# Altium schematic sheet Deneigus_Servo.SchDoc
size Tabloid; Sheet_Name: Alimentation Servo-moteur; Size: 11x17
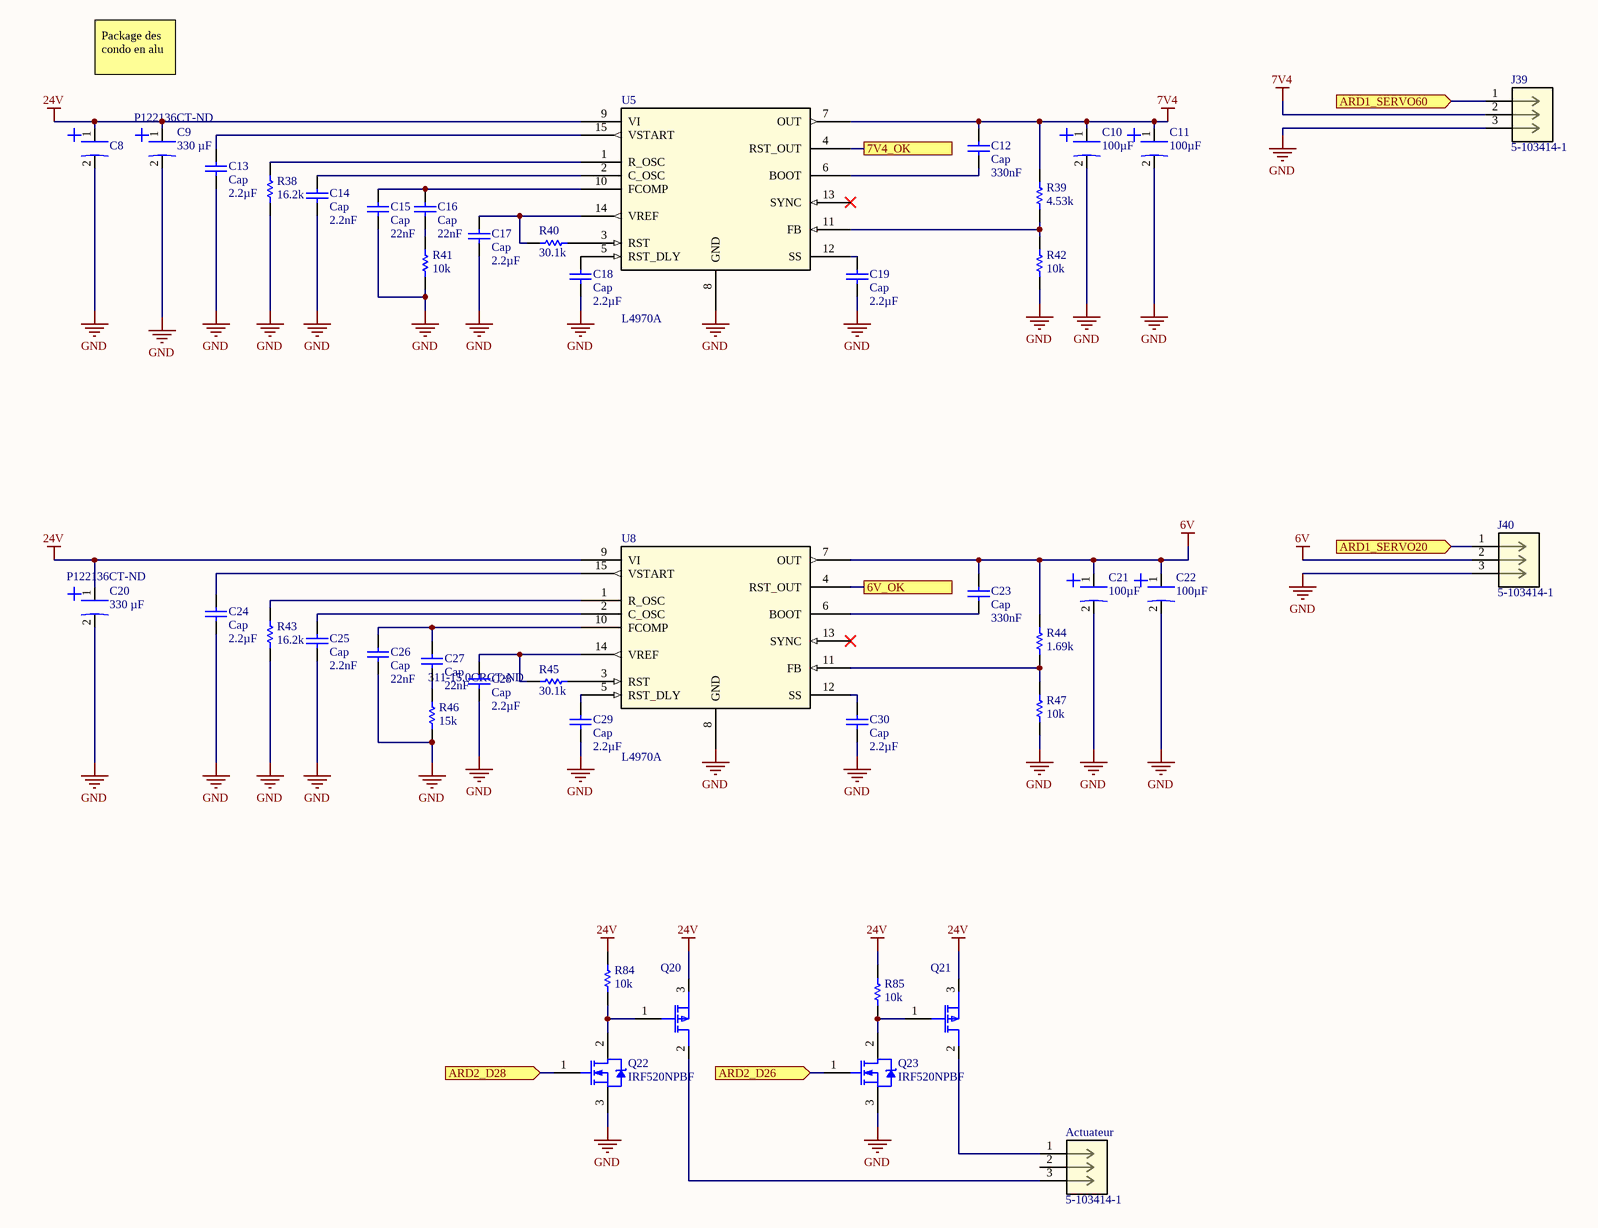
[diagram p0: Deneigus_Servo.SchDoc]

## Parts
Actuateur  5-103414-1  [CONN_5-103414-1_TYCO]
C8  CAP ALUM 3300UF 20% 50V SNAP  [3300 uF 50V Cap]  (value not drawn)
C9  value 330 µF  Supplier Part Number 1: P122136CT-ND  [330uF (10.3x10.3mm)]  (hidden comment: CAP ALUM POLY 47UF 20% 16V SMD)
C10  value 100µF  [47uF]  (hidden comment: CAP ALUM POLY 47UF 20% 16V SMD)
C11  value 100µF  [47uF]  (hidden comment: CAP ALUM POLY 47UF 20% 16V SMD)
C12  Cap  value 330nF  [CAP_0805]
C13  Cap  value 2.2µF  [CAP_0805]
C14  Cap  value 2.2nF  [CAP_0805]
C15  Cap  value 22nF  [RAD-0.3]
C16  Cap  value 22nF  [RAD-0.3]
C17  Cap  value 2.2µF  [CAP_0805]
C18  Cap  value 2.2µF  [CAP_0805]
C19  Cap  value 2.2µF  [CAP_0805]
C20  value 330 µF  Supplier Part Number 1: P122136CT-ND  [330uF (10.3x10.3mm)]  (hidden comment: CAP ALUM POLY 47UF 20% 16V SMD)
C21  value 100µF  [47uF]  (hidden comment: CAP ALUM POLY 47UF 20% 16V SMD)
C22  value 100µF  [47uF]  (hidden comment: CAP ALUM POLY 47UF 20% 16V SMD)
C23  Cap  value 330nF  [CAP_0805]
C24  Cap  value 2.2µF  [CAP_0805]
C25  Cap  value 2.2nF  [CAP_0805]
C26  Cap  value 22nF  [RAD-0.3]
C27  Cap  value 22nF  [RAD-0.3]
C28  Cap  value 2.2µF  [CAP_0805]
C29  Cap  value 2.2µF  [CAP_0805]
C30  Cap  value 2.2µF  [CAP_0805]
J39  5-103414-1  [CONN_5-103414-1_TYCO]
J40  5-103414-1  [CONN_5-103414-1_TYCO]
Q20  MOSFET P-CH 55V 12A TO220AB  [IRF9Z24NPBF]  (value not drawn)
Q21  MOSFET P-CH 55V 12A TO220AB  [IRF9Z24NPBF]  (value not drawn)
Q22  IRF520NPBF  [INTR-TO-220AB-3]
Q23  IRF520NPBF  [INTR-TO-220AB-3]
R38  value 16.2k  [RES_0805]  (hidden comment: Res1)
R39  value 4.53k  [RES_0805]  (hidden comment: Res1)
R40  value 30.1k  [RES_0805]  (hidden comment: Res1)
R41  value 10k  [RES_0805]  (hidden comment: Res1)
R42  value 10k  [RES_0805]  (hidden comment: Res1)
R43  value 16.2k  [RES_0805]  (hidden comment: Res1)
R44  value 1.69k  [RES_0805]  (hidden comment: Res1)
R45  value 30.1k  [RES_0805]  (hidden comment: Res1)
R46  value 15k  Supplier Part Number 1: 311-15.0CRCT-ND  [RES_0805]  (hidden comment: Res1)
R47  value 10k  [RES_0805]  (hidden comment: Res1)
R84  value 10k  [RES_0805]  (hidden comment: Res1)
R85  value 10k  [RES_0805]  (hidden comment: Res1)
U5  L4970A  [Multiwatt15_V_STM]
U8  L4970A  [Multiwatt15_V_STM]

## Ports
6V_OK, 7V4_OK, ARD1_SERVO20 (in), ARD1_SERVO60 (in), ARD2_D26 (in), ARD2_D28 (in)

## Nets
6V: C21.1 C22.1 C23.2 J40.2 R44.1 U8.7(OUT)
7V4: C10.1 C11.1 C12.2 J39.2 R39.1 U5.7(OUT)
24V: C8.1 C9.1 C20.1 Q20.3(Source) Q21.3(Source) R84.1 R85.1 U5.9(VI) U8.9(VI)
GND: C8.2 C9.2 C10.2 C11.2 C13.1 C14.1 C15.1 C17.1 C18.1 C19.1 C20.2 C21.2 C22.2 C24.1 C25.1 C26.1 C28.1 C29.1 C30.1 J39.3 J40.3 Q22.3(S) Q23.3(S) R38.2 R41.2 R42.2 R43.2 R46.2 R47.2 U5.8(GND) U8.8(GND)
6V_OK: U8.4(RST_OUT) ; port 6V_OK
7V4_OK: U5.4(RST_OUT) ; port 7V4_OK
ARD1_SERVO20: J40.1 ; port ARD1_SERVO20
ARD1_SERVO60: J39.1 ; port ARD1_SERVO60
ARD2_D26: Q23.1(G) ; port ARD2_D26
ARD2_D28: Q22.1(G) ; port ARD2_D28
NetActuateur_1: Actuateur.1 Q21.2(Drain)
NetActuateur_3: Actuateur.3 Q20.2(Drain)
NetC12_1: C12.1 U5.6(BOOT)
NetC13_2: C13.2 U5.15(VSTART)
NetC14_2: C14.2 U5.2(C_OSC)
NetC15_2: C15.2 C16.2 U5.10(FCOMP)
NetC16_1: C16.1 R41.1
NetC17_2: C17.2 R40.1 U5.14(VREF)
NetC18_2: C18.2 U5.5(RST_DLY)
NetC19_2: C19.2 U5.12(SS)
NetC23_1: C23.1 U8.6(BOOT)
NetC24_2: C24.2 U8.15(VSTART)
NetC25_2: C25.2 U8.2(C_OSC)
NetC26_2: C26.2 C27.2 U8.10(FCOMP)
NetC27_1: C27.1 R46.1
NetC28_2: C28.2 R45.1 U8.14(VREF)
NetC29_2: C29.2 U8.5(RST_DLY)
NetC30_2: C30.2 U8.12(SS)
NetQ20_1: Q20.1(Gate) Q22.2(D) R84.2
NetQ21_1: Q21.1(Gate) Q23.2(D) R85.2
NetR38_1: R38.1 U5.1(R_OSC)
NetR39_2: R39.2 R42.1 U5.11(FB)
NetR40_2: R40.2 U5.3(RST)
NetR43_1: R43.1 U8.1(R_OSC)
NetR44_2: R44.2 R47.1 U8.11(FB)
NetR45_2: R45.2 U8.3(RST)

Not connected (* = marked no-connect by the designer): Actuateur 2; U5 13(SYNC)*; U8 13(SYNC)*

## Notes on the sheet
- Package des condo en alu
- Sheet Name
- Project Title
- Global Project
- Size
- Group
- Revision
- Date
- Sheet
- of
- Filename
- Designers

## Library data of the parts
Actuateur J39 J40 = 5-103414-1: No Description Available; Vendor: TE Connectivity; Built_By: EMA_UL_Team; SourceLibrary: Tyco_2012-1-03; Manufacturer_Part_Number: 5-103414-1; Copyright: Copyright (C) 2016 Accelerated Designs. All rights reserved; RefDes: RefDes; Type: DEV; Supplier 1: Digikey; Supplier Part Number 1: A32977-ND
C8 = 3300 µF 50V: value: 3300µF; Supplier 1: Digi-Key; Supplier Part Number 1: 338-2545-ND; Voltage: 50V; tolerance: 20%
C9 C20 = 47µF SMD: Mfg Part Number: 875105344006; Mfg: Würth Elektronik; HelpURL: https://www.we-online.de/katalog/datasheet/875105344006.pdf; Supplier 1: Digi-Key
C10 C11 C21 C22 = 47µF SMD: Mfg Part Number: 875105344010; Mfg: Würth Elektronik; Supplier 1: Digikey; Supplier Part Number 1: 732-6425-2-ND; HelpURL: https://www.we-online.de/katalog/datasheet/875105344010.pdf
C12-C19 C23-C30 = Cap: Capacitor; Published: 8-Jun-2000; LatestRevisionDate: 17-Jul-2002; LatestRevisionNote: Re-released for DXP Platform.; Publisher: Altium Limited; PackageDescription: Radial Cap, Thru-Hole; 2 Leads; 0.3 in Pin Spacing
  C12 C23: PackageReference: RAD-0.3; Supplier 1: Digi-Key; Supplier Part Number 1: 1276-1123-1-ND
  C13 C17-C19 C24 C28-C30: PackageReference: RAD-0.3; Supplier 1: Digi-Key; Supplier Part Number 1: 445-5968-1-ND
  C14 C25: PackageReference: 0805; Supplier 1: Digi-Key; Supplier Part Number 1: 1276-1171-1-ND
  C15 C16 C26 C27: PackageReference: RAD-0.3; Supplier 1: Digikey; Supplier Part Number 1: 1276-2488-1-ND
Q20 Q21 = IRF9Z24NPBF: Supplier 1: Digikey; Supplier Part Number 1: IRF9Z24NPBF-ND
Q22 Q23 = CMP-013-00017-4: HEXFET(R) Power MOSFET, 100 V, 9.7 A, 0.2 Ohm, -55 to 175 degC, 3-Pin FM (TO-220AB), RoHS, Tube; Manufacturer: International Rectifier; Power: 48W; Elements: 1; Typical Rise Time: 23ns; Nominal Dual Supply Voltage: 100V; Rds On Max: 200mohm; Input Capacitance: 330pF; Nominal Vgs: 4V; Package Reference: TO-220AB; Max Operating Temperature: 175°C; Datasheet Version: Nov-03; Datasheet URL: http://www.infineon.com/dgdl/irf520npbf.pdf?fileId=5546d462533600a4015355e340711985; Package Quantity: 50; Package Description: 3-Pin Flange Mount, Body 4.445 x 10.415 mm, Pitch 2.54 mm; Pins: 3; Packaging: Rail/Tube; RoHS Compliant: True; Min Operating Temperature: -55°C; Case/Package: TO-220-3; Mounting Technology: TH
R38-R47 R84 R85 = Res1: Resistor; Published: 8-Jun-2000; LatestRevisionDate: 17-Jul-2002; LatestRevisionNote: Re-released for DXP Platform.; PackageReference: AXIAL-0.3; Publisher: Altium Limited; PackageDescription: Axial Device, Thru-Hole; 2 Leads; 0.3 in Pin Spacing
  R38 R43: Supplier 1: digikey; Supplier Part Number 1: 2019-RK73H2ATTD1622FCT-ND
  R39: Supplier 1: digikey; Supplier Part Number 1: RNCP0805FTD4K53CT-ND
  R40 R45: Supplier 1: digikey; Supplier Part Number 1: RMCF0805FT30K1CT-ND
  R41 R42 R47 R84 R85: Supplier 1: digikey; Supplier Part Number 1: RNCP0805FTD10K0CT-ND
  R44: Supplier 1: digikey; Supplier Part Number 1: RMCF0805FT1K69CT-ND
  R46: Supplier 1: Digi-Key
U5 U8 = L4970A: No Description Available; SourceLibrary: Updates_to_database_2020-11-02; Built_By: EMA_UL_Team; Vendor: STMicroelectronics; Manufacturer_Part_Number: L4970A; Copyright: Copyright (C) 2018 Accelerated Designs. All rights reserved; RefDes: RefDes; Type: DEV